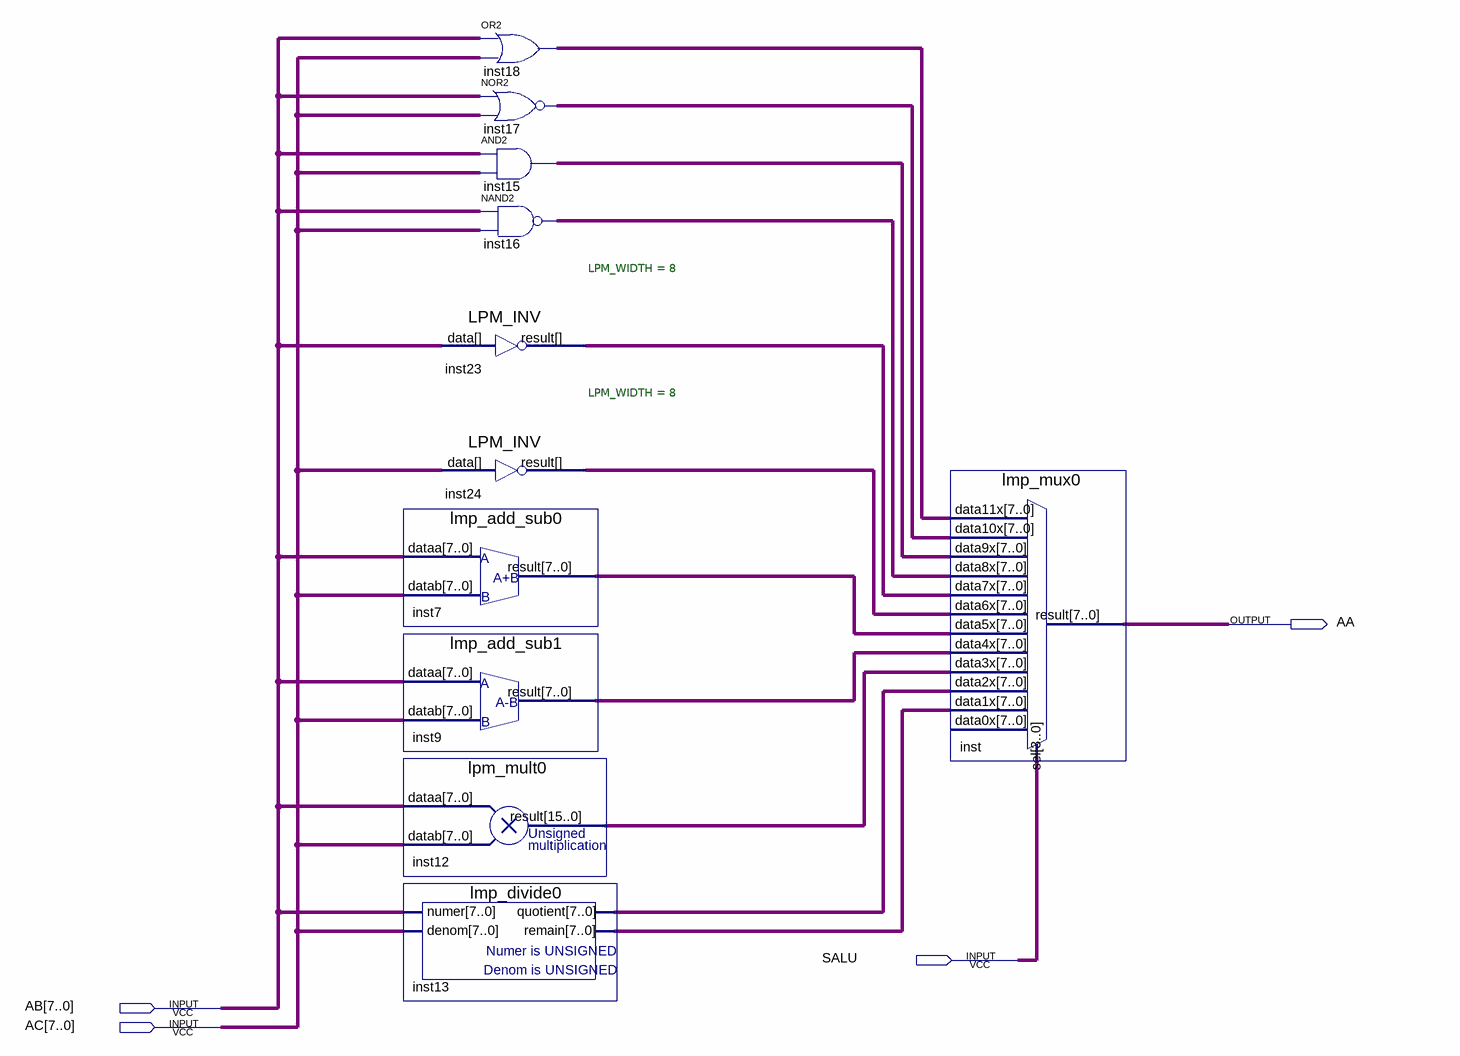
[diagram p0: schematic sheet]
// Quartus schematic ALU.bdf as structural Verilog: 11 symbols, 4 pins
module ALU (
  input  SALU,
  input  [7:0] AB,
  input  [7:0] AC,
  output AA
);

  wire [3:0] undriven;
  wire [7:0] inst7_result, inst9_result, inst13_quotient, inst13_remain, inst15_out, inst16_out, inst17_out,
       inst18_out, inst23_result, inst24_result, inst_result;
  wire [15:0] inst12_result;

  lmp_add_sub0 inst7 (.dataa(AB), .datab(AC), .result(inst7_result));
  lmp_add_sub1 inst9 (.dataa(AB), .datab(AC), .result(inst9_result));
  lpm_mult0 inst12 (.dataa(AB), .datab(AC), .result(inst12_result));
  lmp_divide0 inst13 (.numer(AB), .denom(AC), .quotient(inst13_quotient), .remain(inst13_remain));
  assign inst18_out = AB | AC;  // OR2 inst18, 8 bits wide
  assign inst17_out = ~(AB | AC);  // NOR2 inst17, 8 bits wide
  assign inst15_out = AB & AC;  // AND2 inst15, 8 bits wide
  assign inst16_out = ~(AB & AC);  // NAND2 inst16, 8 bits wide
  LPM_INV #(.LPM_WIDTH(8)) inst23 (.data(AB), .result(inst23_result));
  LPM_INV #(.LPM_WIDTH(8)) inst24 (.data(AC), .result(inst24_result));
  lmp_mux0 inst (
    .data11x(inst18_out), .data10x(inst17_out), .data9x(inst15_out), .data8x(inst16_out),
    .data7x(inst23_result), .data6x(inst24_result), .data5x(inst7_result), .data4x(inst9_result),
    .data3x(inst12_result), .data2x(inst13_quotient), .data1x(inst13_remain), .sel(undriven),
    .result(inst_result));  // open: data0x
endmodule
